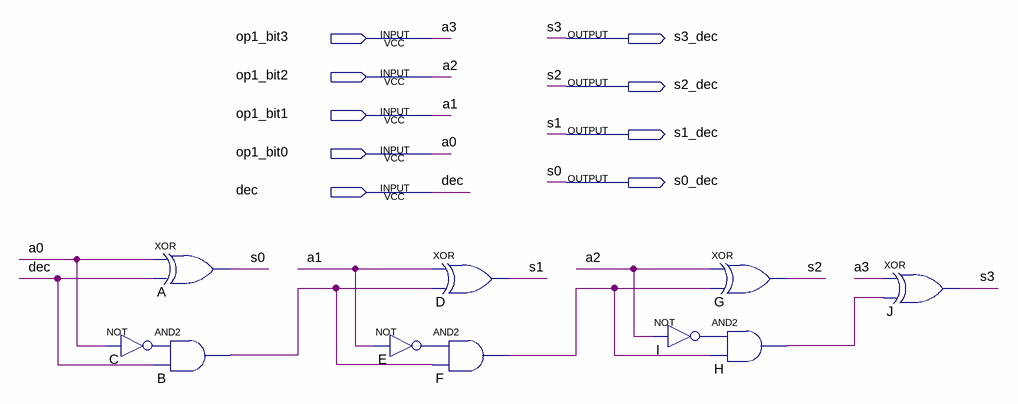
[diagram p0: schematic sheet]
// Quartus schematic dec_4bits.bdf as structural Verilog: 10 symbols, 9 pins
module dec_4bits (
  input  op1_bit3,
  input  op1_bit2,
  input  op1_bit1,
  input  op1_bit0,
  input  dec,
  output s3_dec,
  output s2_dec,
  output s1_dec,
  output s0_dec
);

  wire B_out, C_out, E_out, F_out, H_out, I_out;

  xor A (s0_dec, op1_bit0, dec);
  and B (B_out, C_out, dec);
  not C (C_out, op1_bit0);
  not E (E_out, op1_bit1);
  xor D (s1_dec, op1_bit1, B_out);
  and F (F_out, E_out, B_out);
  xor G (s2_dec, op1_bit2, F_out);
  and H (H_out, I_out, F_out);
  not I (I_out, op1_bit2);
  xor J (s3_dec, op1_bit3, H_out);

  // Other names for the same wires on the sheet: a0 = op1_bit0; a1 = op1_bit1; a2 = op1_bit2; a3 = op1_bit3;
  //   s0 = s0_dec; s1 = s1_dec; s2 = s2_dec; s3 = s3_dec
endmodule
